# EAGLE schematic RH016.1 (EAGLE 7.1.0)
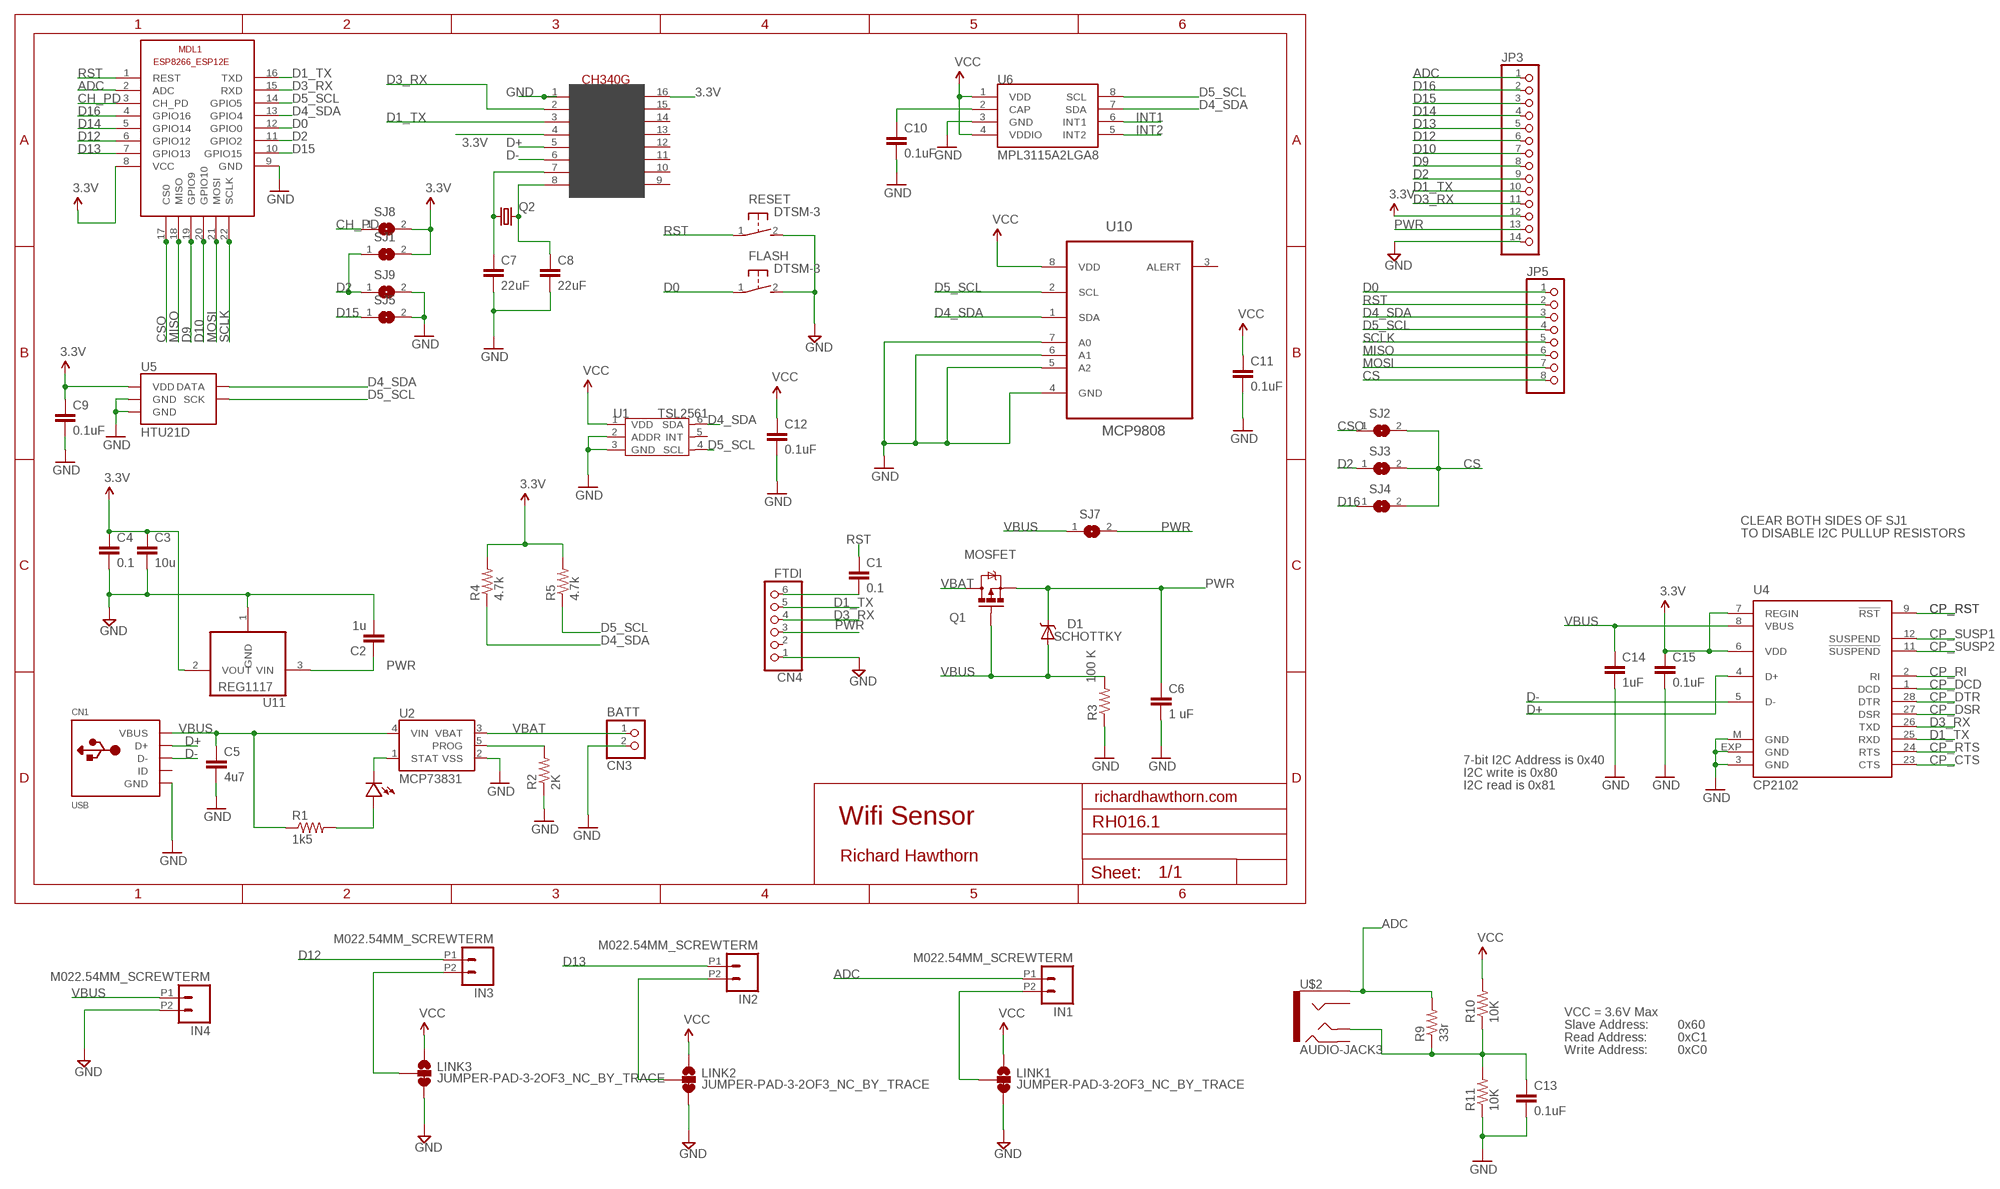
[diagram p0: schematic, sheet 1]

## Parts
C1  0.1  CAP0603-CAP  [0603-CAP]
C2  1u  CAP0603-CAP  [0603-CAP]
C3  10u  CAP0805-CAP  [0805-CAP]
C4  0.1  CAP0603-CAP  [0603-CAP]
C5  4u7  CAP0603-CAP  [0603-CAP]
C6  1 uF  CAP0805  [0805]
C7  22uF  CAP0805  [0805]
C8  22uF  CAP0805  [0805]
C9  0.1uF  CAP0805  [0805]
C10  0.1uF  CAP0805  [0805]
C11  0.1uF  CAP0603-CAP  [0603-CAP]
C12  0.1uF  CAP0603-CAP  [0603-CAP]
C13  0.1uF  CAP0603-CAP  [0603-CAP]
C14  1uF  CAP0603-CAP  [0603-CAP]
C15  0.1uF  CAP0603-CAP  [0603-CAP]
CN1  USB  USBMINIB  [USB-MINIB]
CN3  BATT  JST_2PIN-SMT-RA  [JST-PH-2-SMT-RA]
CN4  FTDI  PINHD-1X6  [1X06]
D1  SCHOTTKY  DIODE-SCHOTTKY_  [SMA-DIODE]
FLASH  DTSM-3  [DTSM-3]
IN1  M022.54MM_SCREWTERM  [1X02_2.54_SCREWTERM]
IN2  M022.54MM_SCREWTERM  [1X02_2.54_SCREWTERM]
IN3  M022.54MM_SCREWTERM  [1X02_2.54_SCREWTERM]
IN4  M022.54MM_SCREWTERM  [1X02_2.54_SCREWTERM]
JP3  PINHD-1X14  [1X14]
JP5  PINHD-1X8  [1X08]
LED1  LED0603  [0603-LED]
LINK1  JUMPER-PAD-3-2OF3_NC_BY_TRACE  [PAD-JUMPER-3-2OF3_NC_BY_TRACE_YES_SILK_FULL_BOX]
LINK2  JUMPER-PAD-3-2OF3_NC_BY_TRACE  [PAD-JUMPER-3-2OF3_NC_BY_TRACE_YES_SILK_FULL_BOX]
LINK3  JUMPER-PAD-3-2OF3_NC_BY_TRACE  [PAD-JUMPER-3-2OF3_NC_BY_TRACE_YES_SILK_FULL_BOX]
MDL1  ESP8266-12EESP8266-ESP12E  [ESP8266-ESP12E]
Q1  MOSFET  MOSFET-PCHANNELSMD  [SOT23-3]
Q2  CRYSTALSM49  [SM49]
R1  1k5  RESISTOR0603-RES  [0603-RES]
R2  2K  RESISTOR0603-RES  [0603-RES]
R3  100 K  RESISTOR0805-RES  [0805]
R4  4.7k  RESISTOR0805-RES  [0805]
R5  4.7k  RESISTOR0805-RES  [0805]
R9  33r  RESISTOR0603-RES  [0603-RES]
R10  10K  RESISTOR0603-RES  [0603-RES]
R11  10K  RESISTOR0603-RES  [0603-RES]
RESET  DTSM-3  [DTSM-3]
SJ1  SJ  [SJ]
SJ2  SJ  [SJ]
SJ3  SJ  [SJ]
SJ4  SJ  [SJ]
SJ5  SJ  [SJ]
SJ7  SJ  [SJ]
SJ8  SJ  [SJ]
SJ9  SJ  [SJ]
U1  TSL2561  TSL2561T  [TMB-6]
U2  MCP73831  [SOT23-5]
U4  CP2102  CP210X_USB_UART  [MLP28]
U5  HTU21D  HTU21DSMD  [HTU21D]
U6  MPL3115A2LGA8  [LGA8]
U10  MCP9808  MCP9808-E/MS  [SOP65P490X110-8N]
U11  REG1117  [SOT223]
U$2  AUDIO-JACK3  [AUDIO-JACK-TRRS-SMD]
U$4  CH340G  [SOIC16]

## Nets
3.3V: C3.1 C4.1 C9.1 C11.1 C12.1 C15.1 JP3.12 LINK1.1 LINK2.1 LINK3.1 MDL1.8(VCC) R4.2 R5.2 R10.2 SJ1.2 SJ8.2 U1.1(VDD) U4.6(VDD) U4.7(REGIN) U5.VDD U6.1(VDD) U6.4(VDDIO) U10.8(VDD) U11.2(VOUT) U$4.4(V3) U$4.16(VCC) ; supply symbol labelled VCC
ADC: IN1.P1 JP3.1 MDL1.2(ADC) R9.2 U$2.EARTH
CH_PD: MDL1.3(CH_PD) SJ8.1
CP_CTS: U4.23(CTS)
CP_DCD: U4.1(DCD)
CP_DSR: U4.27(DSR)
CP_DTR: U4.28(DTR)
CP_RI: U4.2(RI)
CP_RST: U4.9(!RST)
CP_RTS: U4.24(RTS)
CP_SUSP1: U4.12(SUSPEND)
CP_SUSP2: U4.11(!SUSPEND)
CS: JP5.8 SJ2.2 SJ3.2 SJ4.2
CSO: MDL1.17(CS0) SJ2.1
D0: FLASH.1 JP5.1 MDL1.12(GPIO0)
D1_TX: CN4.5 JP3.10 MDL1.16(TXD) U4.25(RXD) U$4.3(RX)
D2: JP3.9 MDL1.11(GPIO2) SJ1.1 SJ3.1 SJ9.1
D3_RX: CN4.4 JP3.11 MDL1.15(RXD) U4.26(TXD) U$4.2(TX)
D4_SDA: JP5.3 MDL1.13(GPIO4) R4.1 U1.6(SDA) U5.DATA U6.7(SDA) U10.1(SDA)
D5_SCL: JP5.4 MDL1.14(GPIO5) R5.1 U1.4(SCL) U5.SCK U6.8(SCL) U10.2(SCL)
D9: JP3.8 MDL1.19(GPIO9)
D10: JP3.7 MDL1.20(GPIO10)
D12: IN3.P1 JP3.6 MDL1.6(GPIO12)
D13: IN2.P1 JP3.5 MDL1.7(GPIO13)
D14: JP3.4 MDL1.5(GPIO14)
D15: JP3.3 MDL1.10(GPIO15) SJ5.1
D16: JP3.2 MDL1.4(GPIO16) SJ4.1
D+: CN1.D+ U4.4(D+) U$4.5(D+)
D-: CN1.D- U4.5(D-) U$4.6(D-)
GND [power]: C2.2 C3.2 C4.2 C5.2 C6.2 C7.2 C8.2 C9.2 C10.2 C11.2 C12.2 C13.2 C14.2 C15.2 CN1.GND CN3.2 CN4.1 FLASH.2 IN4.P2 JP3.14 LINK1.3 LINK2.3 LINK3.3 MDL1.9(GND) R2.1 R3.1 R11.1 RESET.2 SJ5.2 SJ9.2 U1.2(ADDR) U1.3(GND) U2.2(VSS) U4.3(GND) U4.EXP(GND) U4.M(GND) U5.7(GND) U5.GND U6.3(GND) U10.4(GND) U10.5(A2) U10.6(A1) U10.7(A0) U11.1(GND) U$4.1(GND)
INT1: U6.6(INT1)
INT2: U6.5(INT2)
MISO: JP5.6 MDL1.18(MISO)
MOSI: JP5.7 MDL1.21(MOSI)
N$1: C7.1 Q2.1 U$4.7(XI)
N$2: C8.1 Q2.2 U$4.8(XO)
N$4: LED1.PLUS R1.2
N$9: C10.1 U6.2(CAP)
N$13 [power]: IN1.P2 LINK1.2
N$14: C13.1 R9.1 R10.1 R11.2 U$2.TIP
N$15 [power]: IN2.P2 LINK2.2
N$19 [power]: IN3.P2 LINK3.2
N$20: C1.2 CN4.6
PROG: R2.2 U2.5(PROG)
PWR [power]: C2.1 C6.1 CN4.3 D1.C JP3.13 Q1.2(S) SJ7.2 U11.3(VIN)
RST: C1.1 JP5.2 MDL1.1(REST) RESET.1
SCLK: JP5.5 MDL1.22(SCLK)
STAT: LED1.MINUS U2.1(STAT)
VBAT: CN3.1 Q1.3(D) U2.3(VBAT)
VBUS [power]: C5.1 C14.1 CN1.VBUS D1.A IN4.P1 Q1.1(G) R1.1 R3.2 SJ7.1 U2.4(VIN) U4.8(VBUS)
Unconnected: CN1.ID CN4.2 U1.5(INT) U10.3(ALERT) U$2.RING1 U$2.RING2 U$4.9(CTS) U$4.10(DSR) U$4.11(RI) U$4.12(DCD) U$4.13(DTR) U$4.14(RTS) U$4.15(RS232)

## Notes on the sheet
- CLEAR BOTH SIDES OF SJ1
- TO DISABLE I2C PULLUP RESISTORS
- 7-bit I2C Address is 0x40
- I2C write is 0x80
- I2C read is 0x81
- richardhawthorn.com
- Wifi Sensor
- Richard Hawthorn
- VCC = 3.6V Max
- Slave Address: | 0x60
- Read Address: | 0xC1
- Write Address: | 0xC0

## Library data of the parts
C1-C4 = LowPowerLab:CAP: Capacitor Standard 0603 ceramic capacitor, and 0.1" leaded capacitor.
C5 C7-C15 = SparkFun:CAP: Capacitor Standard 0603 ceramic capacitor, and 0.1" leaded capacitor.
C6 = SparkFun-Capacitors:CAP: Capacitor Standard 0603 ceramic capacitor, and 0.1" leaded capacitor.
CN1 = LowPowerLab:USB: USB Connectors USBMINIB - Surface Mount Female Mini-B USB Connector 4UConnector: 06564 By microbuilder.eu Thru-hole RA Female Mini-B USB Connector 4UConnector: 18732 By ladyada.net
CN3 = adafruit:JST_2PIN: JST 2-Pin Connectors of various flavors SMT-RA (S2B-PH-SM4) 4UConnector #17311 SMT (B2B-PH-SM4) THM-RA (S2B-PH) THM (B2B-PH)
CN4 = pinhead:PINHD-1X6: PIN HEADER
D1 = SparkFun-DiscreteSemi:DIODE-SCHOTTKY: Commonly MBRA140.
FLASH RESET = switch-tact:DTSM-3
IN1-IN4 = SparkFun-Connectors:M02: Standard 2-pin 0.1" header. Use with - straight break away headers ( PRT-00116) - right angle break away headers (PRT-00553) - swiss pins (PRT-00743) - machine pins (PRT-00117) - female headers (PRT-00115) Molex polarized connector foot print use with: PRT-08233 with associated crimp pins and housings. 2.54_SCREWTERM for use with PRT-10571. 3.5mm Screw Terminal footprints for PRT-08084 5mm Screw Terminal footprints for use with PRT-08432
JP3 = pinhead:PINHD-1X14: PIN HEADER
JP5 = pinhead:PINHD-1X8: PIN HEADER
LED1 = LowPowerLab:LED
LINK1-LINK3 = SparkFun-Passives:JUMPER-PAD-3-2OF3_NC_BY_TRACE
MDL1 = ESP8266-ESP12E:ESP8266-12E: ESP8266-12E with additional I/O and GPIO04/05 corrected The author cannot warrant that this library is free from error or will meet your specific requirements. Created by PuceBaboon.com. Komagane, Nagano, JAPAN
Q1 = SparkFun-DiscreteSemi:MOSFET-PCHANNEL: Generic PMOSFET
Q2 = crystal:CRYSTAL: CRYSTAL; OC_FARNELL: unknown; OC_NEWARK: unknown
R1 R2 = LowPowerLab:RESISTOR: Resistor Basic schematic elements and footprints for 0603, 1206, and PTH resistors.
R3 = SparkFun-Resistors:RESISTOR: Resistor Basic schematic elements and footprints for 0603, 1206, and PTH resistors.
R4 R5 R9-R11 = SparkFun:RESISTOR: Resistor Basic schematic elements and footprints for 0603, 1206, and PTH resistors.
SJ1-SJ5 SJ7-SJ9 = jumper:SJ: SMD solder JUMPER
U1 = template:TSL2561: Light-TO-Digital Converter
U2 = SparkFun:MCP73831: Microchip's MCP73831 Miniature single cell, fully integrated Li-Ion, Li-polymer charge management controller http://ww1.microchip.com/downloads/en/DeviceDoc/21984a.pdf
U4 = SparkFun:CP210X_USB_UART: Single-Chip USB to UART Bridge Source: www.silabs.com .. CP2101.pdf / cp2102.pdf. Spark Fun Electronics SKU : COM-00310
U5 = SparkFun-Sensors:HTU21D
U6 = SparkFun-Sensors:MPL3115A2: Altimeter/Pressure Sensor, I2C, 1.95V-3.6V supply, 50 to 110kPa
U10 = Richard1:MCP9808-E/MS: Digital Temperature Sensor,MSOP-8; MPN: MCP9808-E/MS; OC_FARNELL: 2080523; OC_NEWARK: 89T8871; PACKAGE: MSOP-8; SUPPLIER: MICROCHIP
U11 = burr-brown:REG1117: 800mA and 1A Low Dropout (LDO) Positive Regulator 1.8V, 2.5V, 2.85V, 3.3V, 5V, and Adj; MPN: REG1117; OC_FARNELL: 1097566; OC_NEWARK: 14P6981
U$2 = SparkFun-Connectors:AUDIO-JACK3: Audio jack - 3.5mm TRRS variety - two rings.
U$4 = usb-serial:CH340G

## Net classes
1 power: width 0.381 mm, clearance 0.254 mm